# EasyEDA schematic SCH_vibration_matrix_element_2022-10-09.json
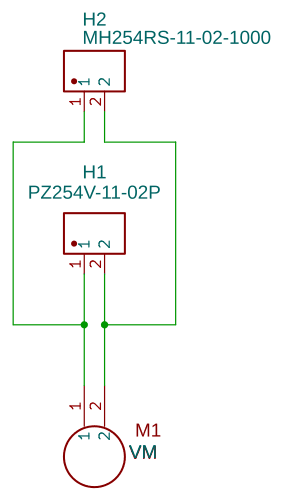
[diagram p0: schematic sheet]

## Parts
H1  PZ254V-11-02P  [HDR-TH_2P-P2.54-V-M]
H2  MH254RS-11-02-1000  [CONN-SMD_MH254RS-11-02-1000]
U1  VM  [VIBRATION_MOTOR]

## Library data of the parts
H1 = PZ254V-11-02P: Supplier: LCSC; Supplier Part: C492401; Manufacturer: XFCN; Contributor: LCSC; JLCPCB Part Class: Extended Part
H2 = MH254RS-11-02-1000: Supplier: LCSC; Supplier Part: C668122; Manufacturer: XFCN; Contributor: LCSC; JLCPCB Part Class: Extended Part
U1 = VM: Supplier: LCSC; Contributor: johnsonwust

## Nets
Net-(H1-1): H1.1 H2.1 U1.1
Net-(H1-2): H1.2 H2.2 U1.2
